# Altium schematic sheet USB.SchDoc
size A4; SheetNumber: 10; SheetTotal: 12
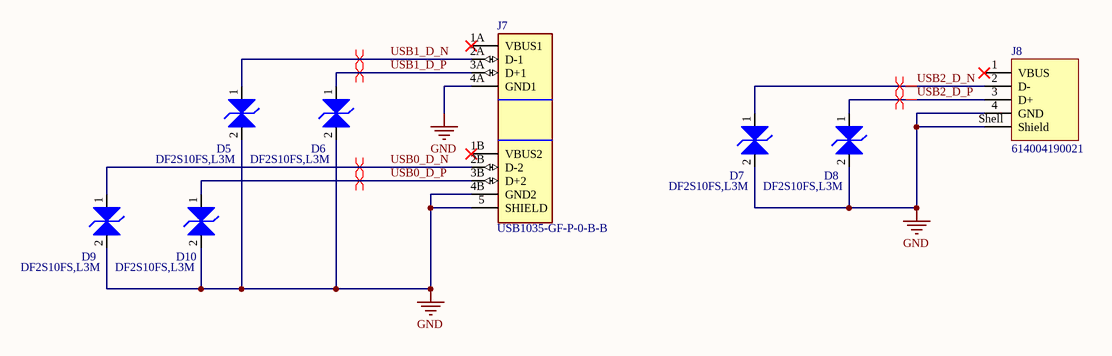
[diagram p0: USB.SchDoc]

## Parts
D5  DF2S10FS,L3M  [DF2S10FS,L3M]
D6  DF2S10FS,L3M  [DF2S10FS,L3M]
D7  DF2S10FS,L3M  [DF2S10FS,L3M]
D8  DF2S10FS,L3M  [DF2S10FS,L3M]
D9  DF2S10FS,L3M  [DF2S10FS,L3M]
D10  DF2S10FS,L3M  [DF2S10FS,L3M]
J7  USB1035-GF-P-0-B-B  [USB1035-GF-P-0-B-B]
J8  614004190021  [614004190021]

## Nets
GND: D5.2 D6.2 D7.2 D8.2 D9.2 D10.2 J7.4A(GND1) J7.4B(GND2) J7.5(SHIELD) J8.4(GND) J8.Shell(Shield)
USB0_D_N: D9.1 J7.2B(D-2)
USB0_D_P: D10.1 J7.3B(D+2)
USB1_D_N: D5.1 J7.2A(D-1)
USB1_D_P: D6.1 J7.3A(D+1)
USB2_D_N: D7.1 J8.2(D-)
USB2_D_P: D8.1 J8.3(D+)

Not connected (* = marked no-connect by the designer): J7 1A(VBUS1)* 1B(VBUS2)*; J8 1(VBUS)*

## Layout directives
differential pair: USB0_D_N, USB0_D_P, USB1_D_N, USB1_D_P, USB2_D_N, USB2_D_P

## Library data of the parts
D5-D10 = DF2S10FS,L3M: TVS Diode 8VRM
J7 = USB1035-GF-P-0-B-B: USB-A (USB TYPE-A), Stacked USB 2.0 Receptacle Connector 8 Position Through Hole, Right Angle; MF: Global Connector Technology; SnapEDA_Link: https://www.snapeda.com/parts/USB1035-GF-P-0-B-B/Global+Connector+Technology/view-part/?ref=snap; Package: None; Value: *; MP: USB1035-GF-P-0-B-B; Check_prices: https://www.snapeda.com/parts/USB1035-GF-P-0-B-B/Global+Connector+Technology/view-part/?ref=eda
J8 = CMP-1502-03228-3: USB Connector, 2.0 TYPE A, RECEPTACLE, THT; Connector Type: USB Type A; Standard: USB 2.0; Gender: Receptacle; No. of...; USB Standard: USB 2.0; Insulation Resistance: 1GΩ; Current Rating: 3A; Number of Contacts: 4; Operating Supply Voltage: 30V; Contact Resistance: 30mΩ; Housing Color: White; Contact Material: Brass; Orientation: Horizontal; Connector Type: USB; Max Operating Temperature: 85°C; Contact Plating: Gold; Number of Pins: 4; REACH SVHC: No; Insulation Material: PBT; Min Operating Temperature: -40°C; Mount: Horizontal, Through Hole; RoHS: Compliant